# Altium schematic sheet EMG_V02.SchDoc
size A1
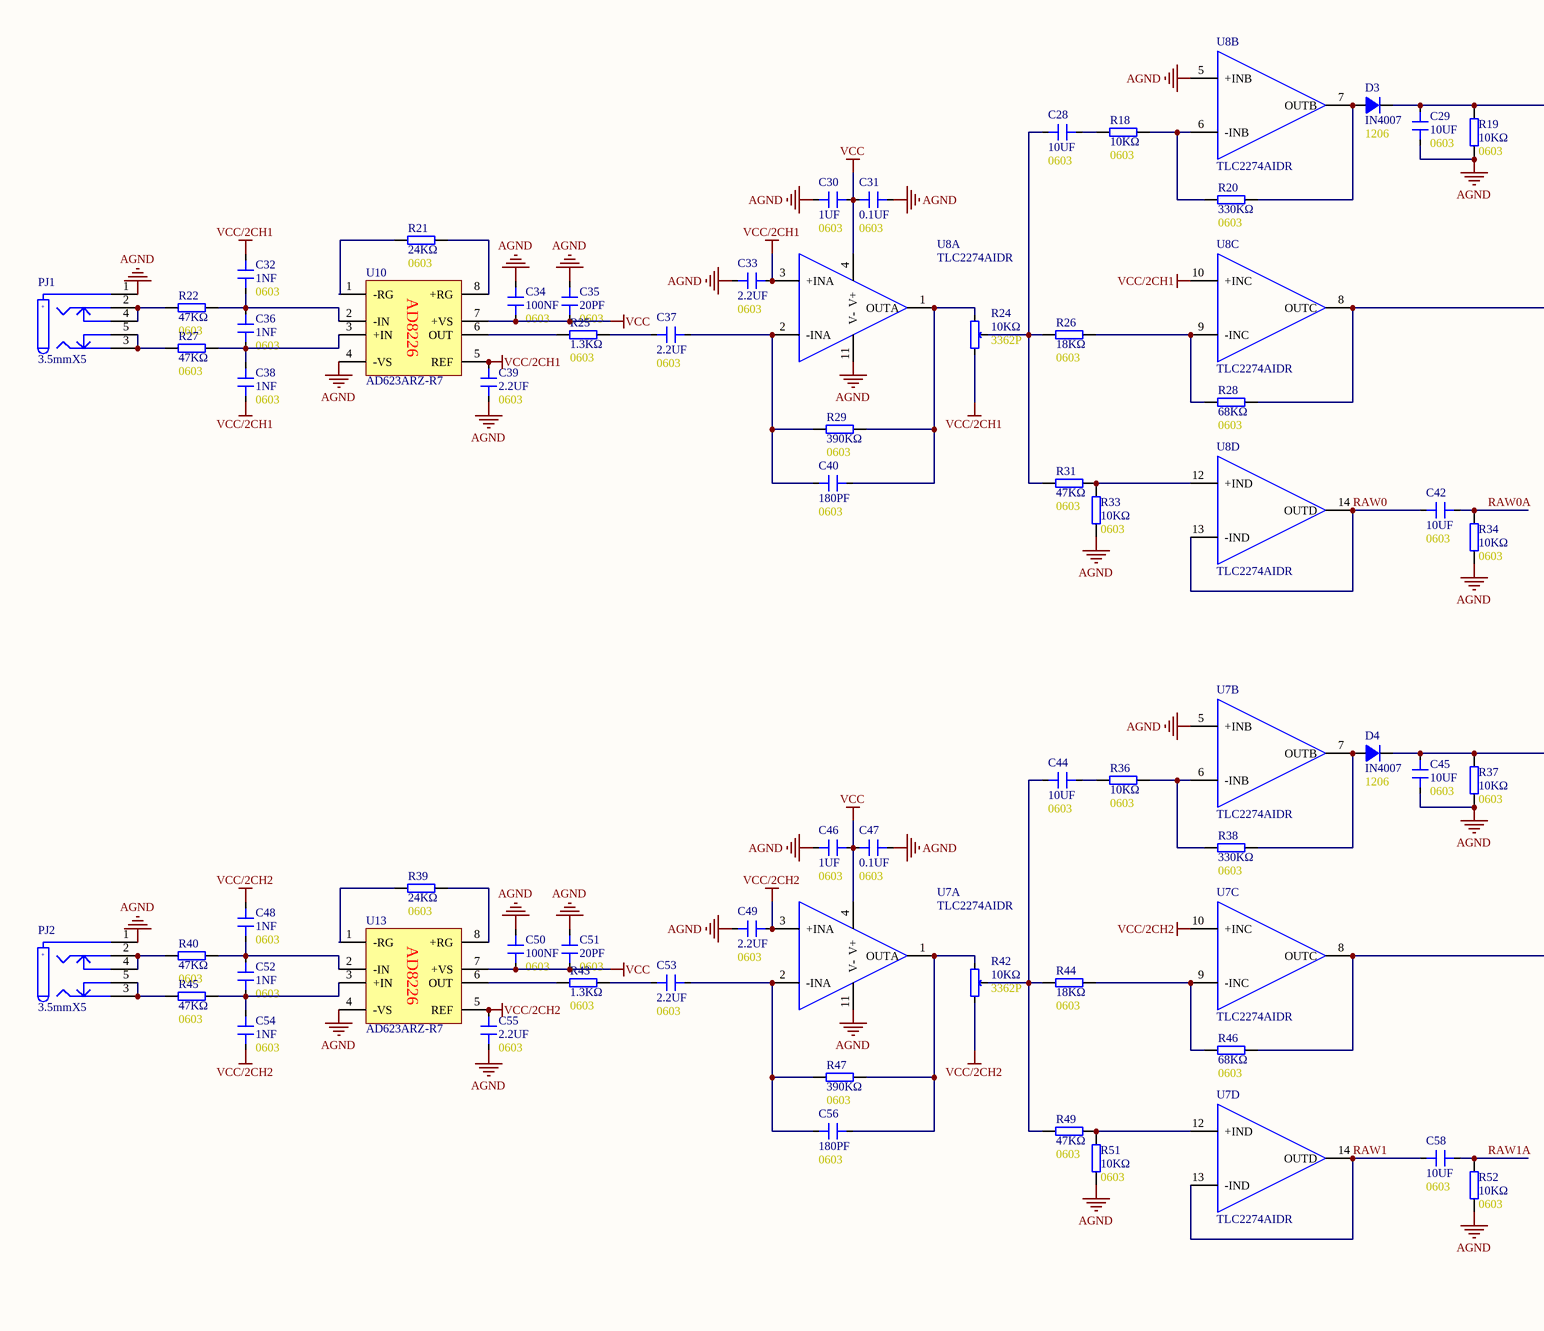
[diagram p0: EMG_V02.SchDoc, top left]
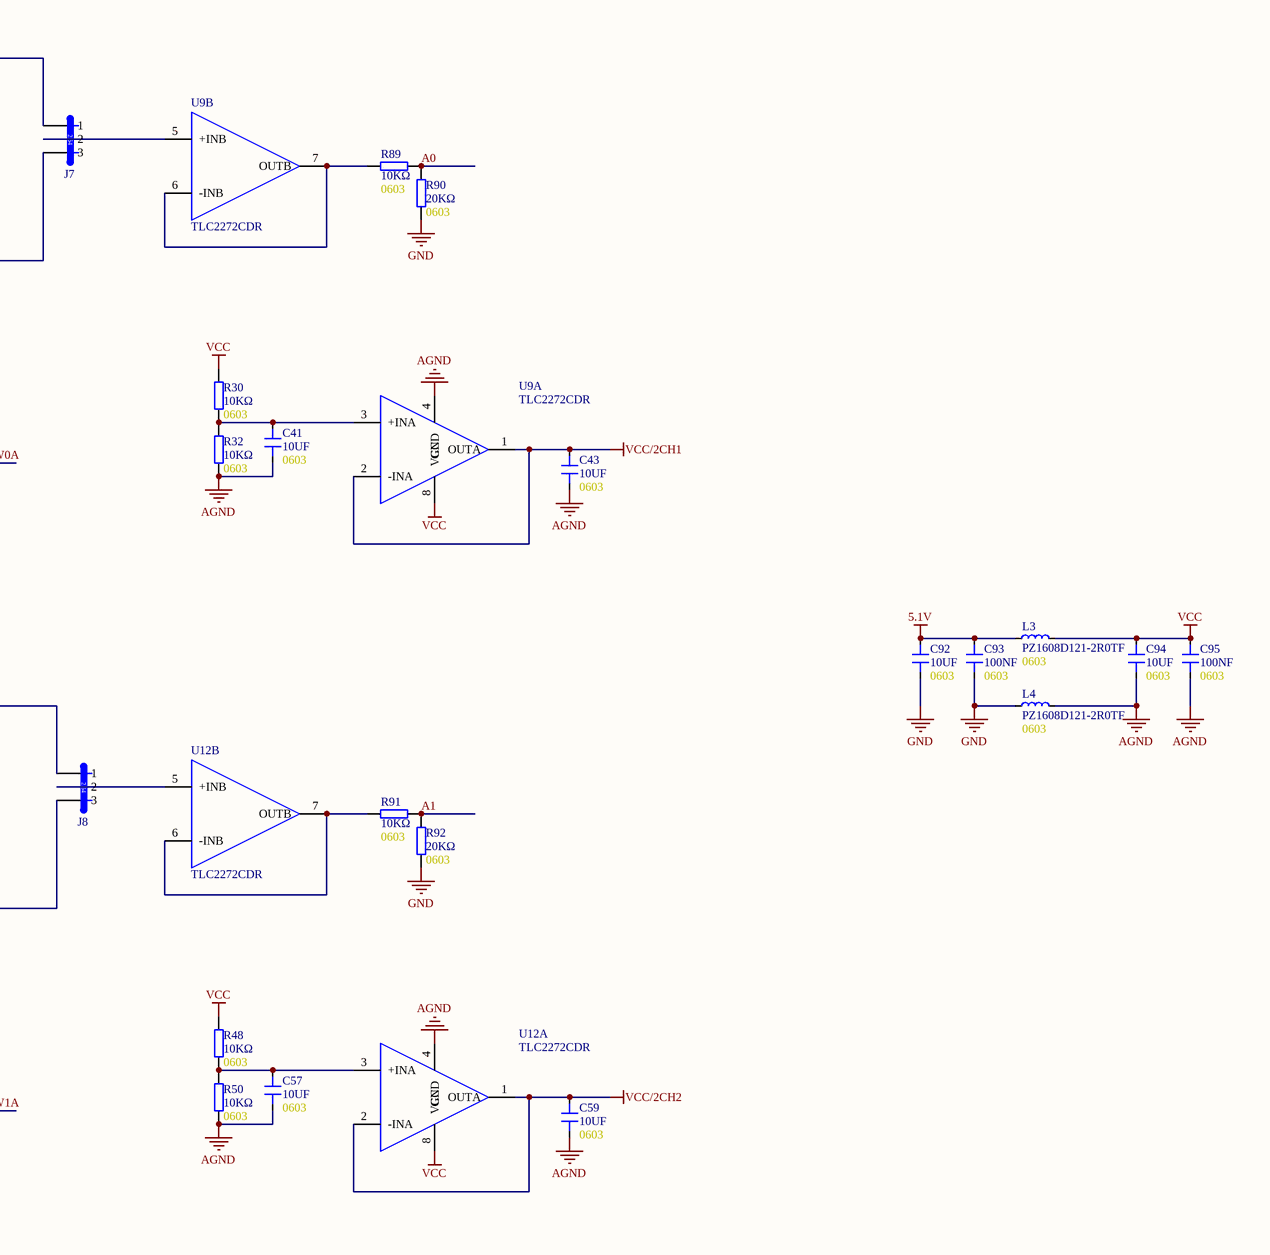
[diagram p1: EMG_V02.SchDoc, top right]
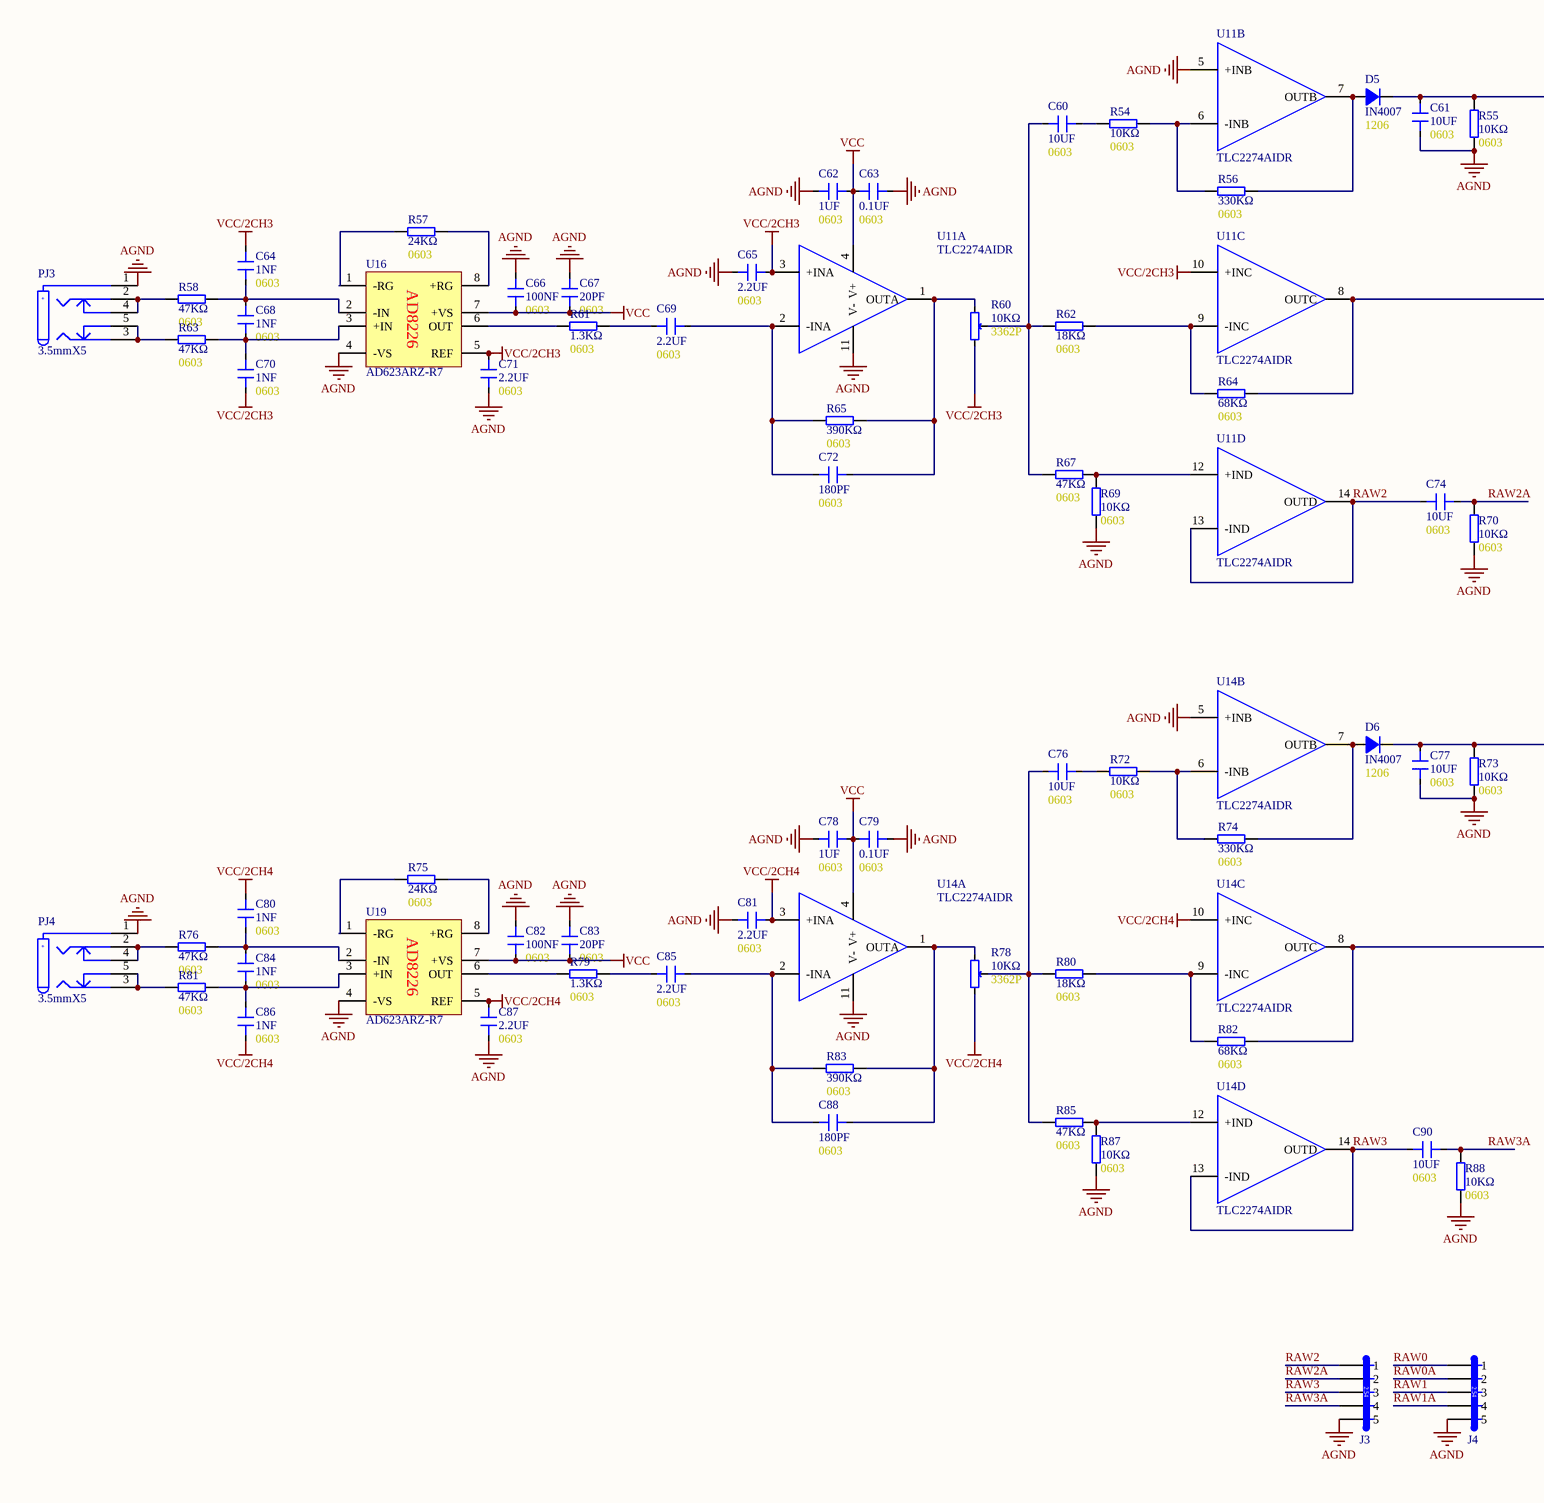
[diagram p2: EMG_V02.SchDoc, bottom left]
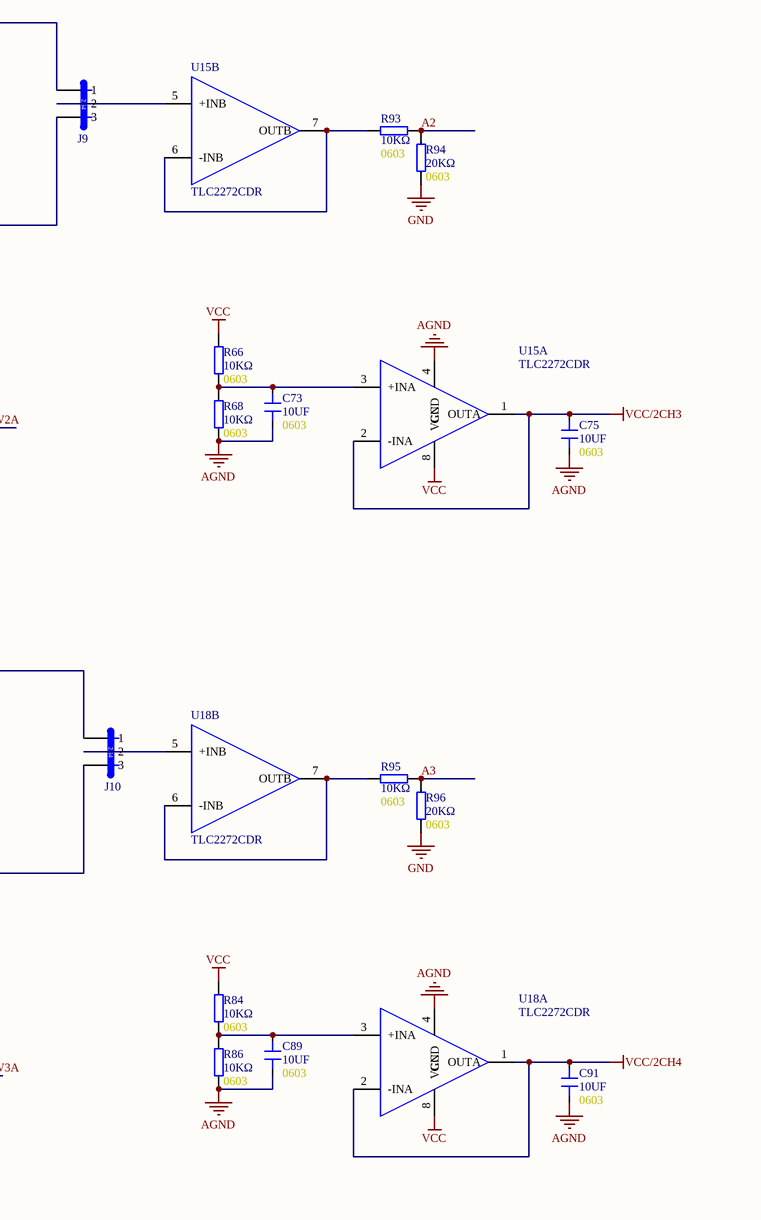
[diagram p3: EMG_V02.SchDoc, bottom right]

## Parts
C28  10UF  封装类型: 0603  [CAP - 0603]
C29  10UF  封装类型: 0603  [CAP - 0603]
C30  1UF  封装类型: 0603  [CAP - 0603]
C31  0.1UF  封装类型: 0603  [CAP - 0603]
C32  1NF  封装类型: 0603  [CAP - 0603]
C33  2.2UF  封装类型: 0603  [CAP - 0603]
C34  100NF  封装类型: 0603  [CAP - 0603]
C35  20PF  封装类型: 0603  [CAP - 0603]
C36  1NF  封装类型: 0603  [CAP - 0603]
C37  2.2UF  封装类型: 0603  [CAP - 0603]
C38  1NF  封装类型: 0603  [CAP - 0603]
C39  2.2UF  封装类型: 0603  [CAP - 0603]
C40  180PF  封装类型: 0603  [CAP - 0603]
C41  10UF  封装类型: 0603  [CAP - 0603]
C42  10UF  封装类型: 0603  [CAP - 0603]
C43  10UF  封装类型: 0603  [CAP - 0603]
C44  10UF  封装类型: 0603  [CAP - 0603]
C45  10UF  封装类型: 0603  [CAP - 0603]
C46  1UF  封装类型: 0603  [CAP - 0603]
C47  0.1UF  封装类型: 0603  [CAP - 0603]
C48  1NF  封装类型: 0603  [CAP - 0603]
C49  2.2UF  封装类型: 0603  [CAP - 0603]
C50  100NF  封装类型: 0603  [CAP - 0603]
C51  20PF  封装类型: 0603  [CAP - 0603]
C52  1NF  封装类型: 0603  [CAP - 0603]
C53  2.2UF  封装类型: 0603  [CAP - 0603]
C54  1NF  封装类型: 0603  [CAP - 0603]
C55  2.2UF  封装类型: 0603  [CAP - 0603]
C56  180PF  封装类型: 0603  [CAP - 0603]
C57  10UF  封装类型: 0603  [CAP - 0603]
C58  10UF  封装类型: 0603  [CAP - 0603]
C59  10UF  封装类型: 0603  [CAP - 0603]
C60  10UF  封装类型: 0603  [CAP - 0603]
C61  10UF  封装类型: 0603  [CAP - 0603]
C62  1UF  封装类型: 0603  [CAP - 0603]
C63  0.1UF  封装类型: 0603  [CAP - 0603]
C64  1NF  封装类型: 0603  [CAP - 0603]
C65  2.2UF  封装类型: 0603  [CAP - 0603]
C66  100NF  封装类型: 0603  [CAP - 0603]
C67  20PF  封装类型: 0603  [CAP - 0603]
C68  1NF  封装类型: 0603  [CAP - 0603]
C69  2.2UF  封装类型: 0603  [CAP - 0603]
C70  1NF  封装类型: 0603  [CAP - 0603]
C71  2.2UF  封装类型: 0603  [CAP - 0603]
C72  180PF  封装类型: 0603  [CAP - 0603]
C73  10UF  封装类型: 0603  [CAP - 0603]
C74  10UF  封装类型: 0603  [CAP - 0603]
C75  10UF  封装类型: 0603  [CAP - 0603]
C76  10UF  封装类型: 0603  [CAP - 0603]
C77  10UF  封装类型: 0603  [CAP - 0603]
C78  1UF  封装类型: 0603  [CAP - 0603]
C79  0.1UF  封装类型: 0603  [CAP - 0603]
C80  1NF  封装类型: 0603  [CAP - 0603]
C81  2.2UF  封装类型: 0603  [CAP - 0603]
C82  100NF  封装类型: 0603  [CAP - 0603]
C83  20PF  封装类型: 0603  [CAP - 0603]
C84  1NF  封装类型: 0603  [CAP - 0603]
C85  2.2UF  封装类型: 0603  [CAP - 0603]
C86  1NF  封装类型: 0603  [CAP - 0603]
C87  2.2UF  封装类型: 0603  [CAP - 0603]
C88  180PF  封装类型: 0603  [CAP - 0603]
C89  10UF  封装类型: 0603  [CAP - 0603]
C90  10UF  封装类型: 0603  [CAP - 0603]
C91  10UF  封装类型: 0603  [CAP - 0603]
C92  10UF  封装类型: 0603  [CAP - 0603]
C93  100NF  封装类型: 0603  [CAP - 0603]
C94  10UF  封装类型: 0603  [CAP - 0603]
C95  100NF  封装类型: 0603  [CAP - 0603]
D3  IN4007  封装类型: 1206  [DIO-1206/SOD123]
D4  IN4007  封装类型: 1206  [DIO-1206/SOD123]
D5  IN4007  封装类型: 1206  [DIO-1206/SOD123]
D6  IN4007  封装类型: 1206  [DIO-1206/SOD123]
J3  2.54mm  [PIN/2.54 - 05X01]  (value not drawn)
J4  2.54mm  [PIN/2.54 - 05X01]  (value not drawn)
J7  2.54mm  [PIN/2.54 - 03X01]  (value not drawn)
J8  2.54mm  [PIN/2.54 - 03X01]  (value not drawn)
J9  2.54mm  [PIN/2.54 - 03X01]  (value not drawn)
J10  2.54mm  [PIN/2.54 - 03X01]  (value not drawn)
L3  PZ1608D121-2R0TF  封装类型: 0603  [IND/SMD-0603]
L4  PZ1608D121-2R0TF  封装类型: 0603  [IND/SMD-0603]
PJ1  封装类型: 3.5mmX5  [PJ/3.5MM]  (hidden comment: PJ-3.5)
PJ2  封装类型: 3.5mmX5  [PJ/3.5MM]  (hidden comment: PJ-3.5)
PJ3  封装类型: 3.5mmX5  [PJ/3.5MM]  (hidden comment: PJ-3.5)
PJ4  封装类型: 3.5mmX5  [PJ/3.5MM]  (hidden comment: PJ-3.5)
R18  10KΩ  封装类型: 0603  [RES/SMD-0603]
R19  10KΩ  封装类型: 0603  [RES/SMD-0603]
R20  330KΩ  封装类型: 0603  [RES/SMD-0603]
R21  24KΩ  封装类型: 0603  [RES/SMD-0603]
R22  47KΩ  封装类型: 0603  [RES/SMD-0603]
R24  10KΩ  封装类型: 3362P  [RES/VARI - 3362P]
R25  1.3KΩ  封装类型: 0603  [RES/SMD-0603]
R26  18KΩ  封装类型: 0603  [RES/SMD-0603]
R27  47KΩ  封装类型: 0603  [RES/SMD-0603]
R28  68KΩ  封装类型: 0603  [RES/SMD-0603]
R29  390KΩ  封装类型: 0603  [RES/SMD-0603]
R30  10KΩ  封装类型: 0603  [RES/SMD-0603]
R31  47KΩ  封装类型: 0603  [RES/SMD-0603]
R32  10KΩ  封装类型: 0603  [RES/SMD-0603]
R33  10KΩ  封装类型: 0603  [RES/SMD-0603]
R34  10KΩ  封装类型: 0603  [RES/SMD-0603]
R36  10KΩ  封装类型: 0603  [RES/SMD-0603]
R37  10KΩ  封装类型: 0603  [RES/SMD-0603]
R38  330KΩ  封装类型: 0603  [RES/SMD-0603]
R39  24KΩ  封装类型: 0603  [RES/SMD-0603]
R40  47KΩ  封装类型: 0603  [RES/SMD-0603]
R42  10KΩ  封装类型: 3362P  [RES/VARI - 3362P]
R43  1.3KΩ  封装类型: 0603  [RES/SMD-0603]
R44  18KΩ  封装类型: 0603  [RES/SMD-0603]
R45  47KΩ  封装类型: 0603  [RES/SMD-0603]
R46  68KΩ  封装类型: 0603  [RES/SMD-0603]
R47  390KΩ  封装类型: 0603  [RES/SMD-0603]
R48  10KΩ  封装类型: 0603  [RES/SMD-0603]
R49  47KΩ  封装类型: 0603  [RES/SMD-0603]
R50  10KΩ  封装类型: 0603  [RES/SMD-0603]
R51  10KΩ  封装类型: 0603  [RES/SMD-0603]
R52  10KΩ  封装类型: 0603  [RES/SMD-0603]
R54  10KΩ  封装类型: 0603  [RES/SMD-0603]
R55  10KΩ  封装类型: 0603  [RES/SMD-0603]
R56  330KΩ  封装类型: 0603  [RES/SMD-0603]
R57  24KΩ  封装类型: 0603  [RES/SMD-0603]
R58  47KΩ  封装类型: 0603  [RES/SMD-0603]
R60  10KΩ  封装类型: 3362P  [RES/VARI - 3362P]
R61  1.3KΩ  封装类型: 0603  [RES/SMD-0603]
R62  18KΩ  封装类型: 0603  [RES/SMD-0603]
R63  47KΩ  封装类型: 0603  [RES/SMD-0603]
R64  68KΩ  封装类型: 0603  [RES/SMD-0603]
R65  390KΩ  封装类型: 0603  [RES/SMD-0603]
R66  10KΩ  封装类型: 0603  [RES/SMD-0603]
R67  47KΩ  封装类型: 0603  [RES/SMD-0603]
R68  10KΩ  封装类型: 0603  [RES/SMD-0603]
R69  10KΩ  封装类型: 0603  [RES/SMD-0603]
R70  10KΩ  封装类型: 0603  [RES/SMD-0603]
R72  10KΩ  封装类型: 0603  [RES/SMD-0603]
R73  10KΩ  封装类型: 0603  [RES/SMD-0603]
R74  330KΩ  封装类型: 0603  [RES/SMD-0603]
R75  24KΩ  封装类型: 0603  [RES/SMD-0603]
R76  47KΩ  封装类型: 0603  [RES/SMD-0603]
R78  10KΩ  封装类型: 3362P  [RES/VARI - 3362P]
R79  1.3KΩ  封装类型: 0603  [RES/SMD-0603]
R80  18KΩ  封装类型: 0603  [RES/SMD-0603]
R81  47KΩ  封装类型: 0603  [RES/SMD-0603]
R82  68KΩ  封装类型: 0603  [RES/SMD-0603]
R83  390KΩ  封装类型: 0603  [RES/SMD-0603]
R84  10KΩ  封装类型: 0603  [RES/SMD-0603]
R85  47KΩ  封装类型: 0603  [RES/SMD-0603]
R86  10KΩ  封装类型: 0603  [RES/SMD-0603]
R87  10KΩ  封装类型: 0603  [RES/SMD-0603]
R88  10KΩ  封装类型: 0603  [RES/SMD-0603]
R89  10KΩ  封装类型: 0603  [RES/SMD-0603]
R90  20KΩ  封装类型: 0603  [RES/SMD-0603]
R91  10KΩ  封装类型: 0603  [RES/SMD-0603]
R92  20KΩ  封装类型: 0603  [RES/SMD-0603]
R93  10KΩ  封装类型: 0603  [RES/SMD-0603]
R94  20KΩ  封装类型: 0603  [RES/SMD-0603]
R95  10KΩ  封装类型: 0603  [RES/SMD-0603]
R96  20KΩ  封装类型: 0603  [RES/SMD-0603]
U7  TLC2274AIDR  [SOP-14/150MIL]  (parts A,B,C,D of 4)
U8  TLC2274AIDR  [SOP-14/150MIL]  (parts A,B,C,D of 4)
U9  TLC2272CDR  [SOP-08/150MIL]  (parts A,B of 2)
U10  AD623ARZ-R7  [SOP-08/150MIL]
U11  TLC2274AIDR  [SOP-14/150MIL]  (parts A,B,C,D of 4)
U12  TLC2272CDR  [SOP-08/150MIL]  (parts A,B of 2)
U13  AD623ARZ-R7  [SOP-08/150MIL]
U14  TLC2274AIDR  [SOP-14/150MIL]  (parts A,B,C,D of 4)
U15  TLC2272CDR  [SOP-08/150MIL]  (parts A,B of 2)
U16  AD623ARZ-R7  [SOP-08/150MIL]
U18  TLC2272CDR  [SOP-08/150MIL]  (parts A,B of 2)
U19  AD623ARZ-R7  [SOP-08/150MIL]

## Nets
5.1V: C92.2 C93.2 L3.1
AGND: C29.2 C30.2 C31.1 C33.2 C34.2 C35.2 C39.1 C41.2 C43.2 C45.2 C46.2 C47.1 C49.2 C50.2 C51.2 C55.1 C57.2 C59.2 C61.2 C62.2 C63.1 C65.2 C66.2 C67.2 C71.1 C73.2 C75.2 C77.2 C78.2 C79.1 C81.2 C82.2 C83.2 C87.1 C89.2 C91.2 C94.1 C95.1 J3.5 J4.5 L4.2 PJ1.1 PJ2.1 PJ3.1 PJ4.1 R19.1 R32.2 R33.1 R34.1 R37.1 R50.2 R51.1 R52.1 R55.1 R68.2 R69.1 R70.1 R73.1 R86.2 R87.1 R88.1 U7.5(+INB) U7.11(V-) U8.5(+INB) U8.11(V-) U9.4(GND) U10.4(-VS) U11.5(+INB) U11.11(V-) U12.4(GND) U13.4(-VS) U14.5(+INB) U14.11(V-) U15.4(GND) U16.4(-VS) U18.4(GND) U19.4(-VS)
GND: C92.1 C93.1 L4.1 R90.1 R92.1 R94.1 R96.1
VCC: C30.1 C31.2 C34.1 C35.1 C46.1 C47.2 C50.1 C51.1 C62.1 C63.2 C66.1 C67.1 C78.1 C79.2 C82.1 C83.1 C94.2 C95.2 L3.2 R30.1 R48.1 R66.1 R84.1 U7.4(V+) U8.4(V+) U9.8(VCC) U10.7(+VS) U11.4(V+) U12.8(VCC) U13.7(+VS) U14.4(V+) U15.8(VCC) U16.7(+VS) U18.8(VCC) U19.7(+VS)
VCC/2CH1: C32.2 C33.1 C38.1 C39.2 C43.1 R24.2 U8.3(+INA) U8.10(+INC) U9.1(OUTA) U9.2(-INA) U10.5(REF)
VCC/2CH2: C48.2 C49.1 C54.1 C55.2 C59.1 R42.2 U7.3(+INA) U7.10(+INC) U12.1(OUTA) U12.2(-INA) U13.5(REF)
VCC/2CH3: C64.2 C65.1 C70.1 C71.2 C75.1 R60.2 U11.3(+INA) U11.10(+INC) U15.1(OUTA) U15.2(-INA) U16.5(REF)
VCC/2CH4: C80.2 C81.1 C86.1 C87.2 C91.1 R78.2 U14.3(+INA) U14.10(+INC) U18.1(OUTA) U18.2(-INA) U19.5(REF)
A0: R89.2 R90.2
A1: R91.2 R92.2
A2: R93.2 R94.2
A3: R95.2 R96.2
RAW0: C42.2 J4.1 U8.13(-IND) U8.14(OUTD)
RAW0A: C42.1 J4.2 R34.2
RAW1: C58.2 J4.3 U7.13(-IND) U7.14(OUTD)
RAW1A: C58.1 J4.4 R52.2
RAW2: C74.2 J3.1 U11.13(-IND) U11.14(OUTD)
RAW2A: C74.1 J3.2 R70.2
RAW3: C90.2 J3.3 U14.13(-IND) U14.14(OUTD)
RAW3A: C90.1 J3.4 R88.2
NetC28_1: C28.1 R18.1
NetC28_2: C28.2 R24.W R26.1 R31.1
NetC29_1: C29.1 D3.2 J7.1 R19.2
NetC32_1: C32.1 C36.2 R22.2 U10.2(-IN)
NetC36_1: C36.1 C38.2 R27.2 U10.3(+IN)
NetC37_1: C37.1 C40.2 R29.1 U8.2(-INA)
NetC37_2: C37.2 R25.2
NetC40_1: C40.1 R24.1 R29.2 U8.1(OUTA)
NetC41_1: C41.1 R30.2 R32.1 U9.3(+INA)
NetC44_1: C44.1 R36.1
NetC44_2: C44.2 R42.W R44.1 R49.1
NetC45_1: C45.1 D4.2 J8.1 R37.2
NetC48_1: C48.1 C52.2 R40.2 U13.2(-IN)
NetC52_1: C52.1 C54.2 R45.2 U13.3(+IN)
NetC53_1: C53.1 C56.2 R47.1 U7.2(-INA)
NetC53_2: C53.2 R43.2
NetC56_1: C56.1 R42.1 R47.2 U7.1(OUTA)
NetC57_1: C57.1 R48.2 R50.1 U12.3(+INA)
NetC60_1: C60.1 R54.1
NetC60_2: C60.2 R60.W R62.1 R67.1
NetC61_1: C61.1 D5.2 J9.1 R55.2
NetC64_1: C64.1 C68.2 R58.2 U16.2(-IN)
NetC68_1: C68.1 C70.2 R63.2 U16.3(+IN)
NetC69_1: C69.1 C72.2 R65.1 U11.2(-INA)
NetC69_2: C69.2 R61.2
NetC72_1: C72.1 R60.1 R65.2 U11.1(OUTA)
NetC73_1: C73.1 R66.2 R68.1 U15.3(+INA)
NetC76_1: C76.1 R72.1
NetC76_2: C76.2 R78.W R80.1 R85.1
NetC77_1: C77.1 D6.2 J10.1 R73.2
NetC80_1: C80.1 C84.2 R76.2 U19.2(-IN)
NetC84_1: C84.1 C86.2 R81.2 U19.3(+IN)
NetC85_1: C85.1 C88.2 R83.1 U14.2(-INA)
NetC85_2: C85.2 R79.2
NetC88_1: C88.1 R78.1 R83.2 U14.1(OUTA)
NetC89_1: C89.1 R84.2 R86.1 U18.3(+INA)
NetD3_1: D3.1 R20.2 U8.7(OUTB)
NetD4_1: D4.1 R38.2 U7.7(OUTB)
NetD5_1: D5.1 R56.2 U11.7(OUTB)
NetD6_1: D6.1 R74.2 U14.7(OUTB)
NetJ7_2: J7.2 U9.5(+INB)
NetJ7_3: J7.3 R28.2 U8.8(OUTC)
NetJ8_2: J8.2 U12.5(+INB)
NetJ8_3: J8.3 R46.2 U7.8(OUTC)
NetJ9_2: J9.2 U15.5(+INB)
NetJ9_3: J9.3 R64.2 U11.8(OUTC)
NetJ10_2: J10.2 U18.5(+INB)
NetJ10_3: J10.3 R82.2 U14.8(OUTC)
NetPJ1_2: PJ1.2 PJ1.4 R22.1
NetPJ1_3: PJ1.3 PJ1.5 R27.1
NetPJ2_2: PJ2.2 PJ2.4 R40.1
NetPJ2_3: PJ2.3 PJ2.5 R45.1
NetPJ3_2: PJ3.2 PJ3.4 R58.1
NetPJ3_3: PJ3.3 PJ3.5 R63.1
NetPJ4_2: PJ4.2 PJ4.4 R76.1
NetPJ4_3: PJ4.3 PJ4.5 R81.1
NetR18_2: R18.2 R20.1 U8.6(-INB)
NetR21_1: R21.1 U10.1(-RG)
NetR21_2: R21.2 U10.8(+RG)
NetR25_1: R25.1 U10.6(OUT)
NetR26_2: R26.2 R28.1 U8.9(-INC)
NetR31_2: R31.2 R33.2 U8.12(+IND)
NetR36_2: R36.2 R38.1 U7.6(-INB)
NetR39_1: R39.1 U13.1(-RG)
NetR39_2: R39.2 U13.8(+RG)
NetR43_1: R43.1 U13.6(OUT)
NetR44_2: R44.2 R46.1 U7.9(-INC)
NetR49_2: R49.2 R51.2 U7.12(+IND)
NetR54_2: R54.2 R56.1 U11.6(-INB)
NetR57_1: R57.1 U16.1(-RG)
NetR57_2: R57.2 U16.8(+RG)
NetR61_1: R61.1 U16.6(OUT)
NetR62_2: R62.2 R64.1 U11.9(-INC)
NetR67_2: R67.2 R69.2 U11.12(+IND)
NetR72_2: R72.2 R74.1 U14.6(-INB)
NetR75_1: R75.1 U19.1(-RG)
NetR75_2: R75.2 U19.8(+RG)
NetR79_1: R79.1 U19.6(OUT)
NetR80_2: R80.2 R82.1 U14.9(-INC)
NetR85_2: R85.2 R87.2 U14.12(+IND)
NetR89_1: R89.1 U9.6(-INB) U9.7(OUTB)
NetR91_1: R91.1 U12.6(-INB) U12.7(OUTB)
NetR93_1: R93.1 U15.6(-INB) U15.7(OUTB)
NetR95_1: R95.1 U18.6(-INB) U18.7(OUTB)

## Notes on the sheet
- (in symbol AD623ARZ-R7) AD8226
- (in symbol PIN/2.54 - 03X01) 2.54
- (in symbol PIN/2.54 - 05X01) 2.54
- (in symbol PJ/3.5MM) ＋

## Library data of the parts
C28-C95 = CAP - 0603: 贴片电容，0603封装
D3-D6 = DIO/1206: 二极管，SOD123/1206封装
J3 J4 = PIN/2.54 - 05X01: 普通插针，间距2.54mm，05X01
J7-J10 = PIN/2.54 - 03X01: 普通插针，间距2.54mm，03X01
L3 L4 = IND/SMD-0603: 贴片电感，0603封装
PJ1-PJ4 = PJ/3.5MM: 耳机插座，3.5MM，直插5脚
R18-R22 R25-R34 R36-R40 R43-R52 R54-R58 R61-R70 R72-R76 R79-R96 = RES/SMD-0603: 1/10W，50V，贴片电阻，0603封装
R24 R42 R60 R78 = RES/VARI-3362P: 可变电阻，3362P型号
U7 U8 U11 U14 = TLC2274AIDR: 精密运算放大器
U9 U12 U15 U18 = TLC2272CDR: 精密运算放大器，双通道
U10 U13 U16 U19 = AD623ARZ-R7: 仪表放大器